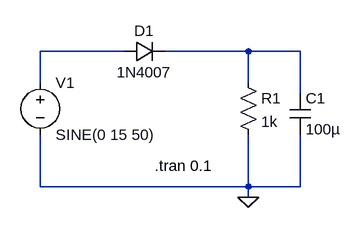
[diagram p0: schematic hwr.asc]
hwr.asc, the LTspice schematic file:
Version 4
SHEET 1 880 680
WIRE 192 96 64 96
WIRE 384 96 256 96
WIRE 464 96 384 96
WIRE 64 144 64 96
WIRE 384 144 384 96
WIRE 464 160 464 96
WIRE 64 304 64 224
WIRE 384 304 384 224
WIRE 384 304 64 304
WIRE 464 304 464 224
WIRE 464 304 384 304
WIRE 384 320 384 304
FLAG 384 320 0
SYMBOL voltage 64 128 R0
WINDOW 123 0 0 Left 0
WINDOW 39 0 0 Left 0
SYMATTR InstName V1
SYMATTR Value SINE(0 15 50)
SYMBOL diode 192 112 R270
WINDOW 0 32 32 VTop 2
WINDOW 3 0 32 VBottom 2
SYMATTR InstName D1
SYMATTR Value 1N4007
SYMBOL res 368 128 R0
SYMATTR InstName R1
SYMATTR Value 1k
SYMBOL cap 448 160 R0
SYMATTR InstName C1
SYMATTR Value 100µ
TEXT 240 272 Left 2 !.tran 0.1

The netlist it stands for:
* hwr.asc
V1 N001 0 SINE(0 15 50)
D1 N001 N002 1N4007
R1 N002 0 1k
C1 N002 0 100µ
.model D D
.lib standard.dio
.tran 0.1
.backanno
.end